# Altium schematic sheet actuatorDriver.SchDoc
size A4
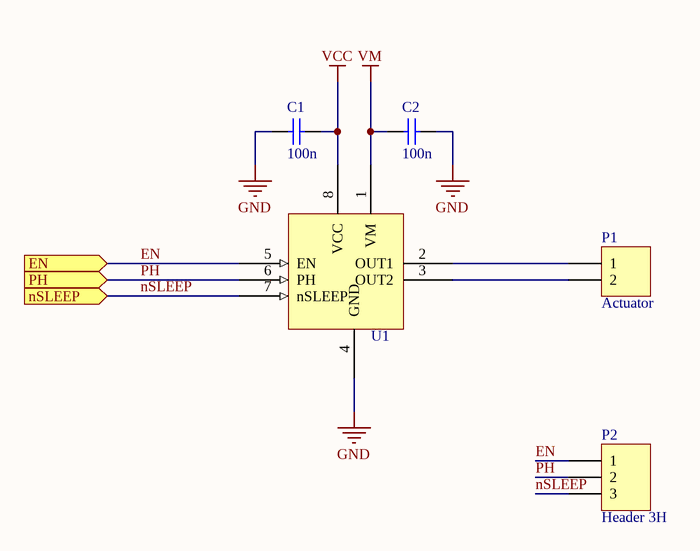
[diagram p0: actuatorDriver.SchDoc]

## Parts
C1  100n  [CAP 0603/1608]
C2  100n  [CAP 0603/1608]
P1  Actuator  [HDR1X2]
P2  Header 3H  [HDR1X3]
U1  DRV8838  [S-PWSON-N8]  (value not drawn)

## Ports
EN (in), nSLEEP (in), PH (in)

## Nets
GND: C1.2 C2.1 U1.4(GND)
VCC: C1.1 U1.8(VCC)
VM: C2.2 U1.1(VM)
EN: P2.1 U1.5(EN) ; port EN
nSLEEP: P2.3 U1.7(nSLEEP) ; port nSLEEP
PH: P2.2 U1.6(PH) ; port PH
NetP1_1: P1.1 U1.2(OUT1)
NetP1_2: P1.2 U1.3(OUT2)

## Library data of the parts
C1 C2 = Cap: MULTICOMP  MCSH21B104K100CT  Condensateur céramique multicouche CMS, 0805 [2012 Metric], 0.1 µF, 10 V, ± 10%, X7R, Série MCSH; Fournisseur: Farnell; RefFournisseur: 1856422; Fabricant: MULTICOMP; Footprint: 0603; RefFabricant: MCSH21B104K100CT; Value: 100n
P1 = Header 2: Header, 2-Pin; LatestRevisionDate: 17-Jul-2002; LatestRevisionNote: Re-released for DXP Platform.; Publisher: Altium Limited
P2 = Header 3H: WURTH ELEKTRONIK  61300611121  Connecteur carte-à-carte, Vertical, 2.54 mm, 6 Contact(s), Embase, Série WR-PHD, Traversant; Fournisseur: Farnell; RefFournisseur: 2356158; Fabricant: WURTH ELEKTRONIK; RefFabricant: 61300611121
U1 = DRV8838: Moteur Driver [H - bridge]; Fabricant: Texas instrument; Fournisseur: farnell; RefFournisseur: 2420232; RefFabricant: DRV8838DSGT